# Altium schematic sheet load-sw.SchDoc
size A4
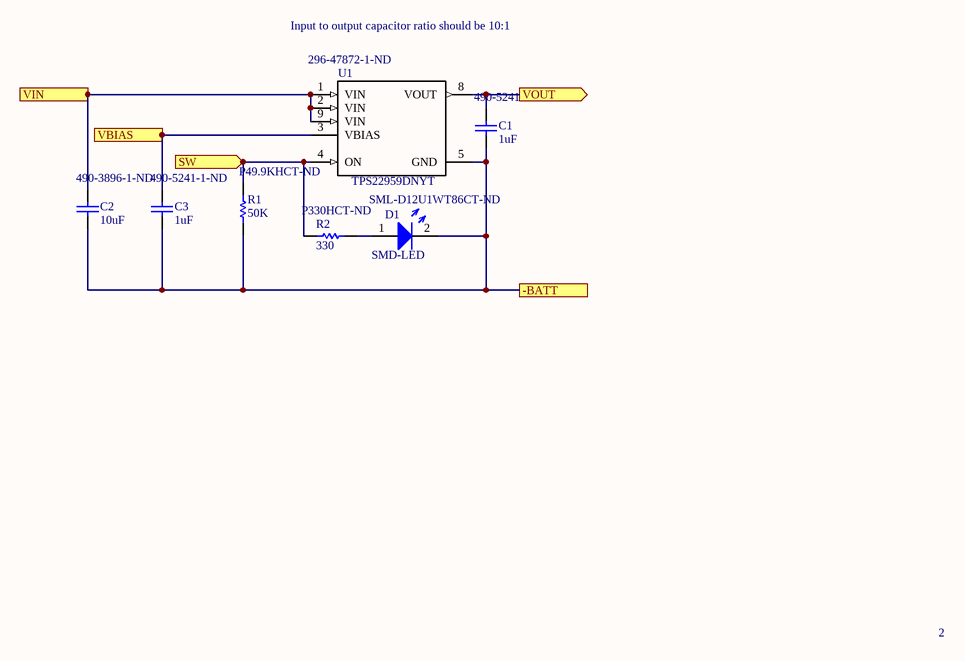
[diagram p0: load-sw.SchDoc]

## Parts
C1  1uF  Supplier Part Number 1: 490-5241-1-ND  [1608[0603]]
C2  10uF  Supplier Part Number 1: 490-3896-1-ND  [1608[0603]]
C3  1uF  Supplier Part Number 1: 490-5241-1-ND  [1608[0603]]
D1  SMD-LED  Supplier Part Number 1: SML-D12U1WT86CT-ND  [0603-LED]
R1  50K  Supplier Part Number 1: P49.9KHCT-ND  [1608[0603]]
R2  330  Supplier Part Number 1: P330HCT-ND  [1608[0603]]
U1  TPS22959DNYT  Supplier Part Number 1: 296-47872-1-ND  [TPS22959DNYT]

## Ports
-BATT, SW (in), VBIAS, VIN (in), VOUT (out)

## Nets
-BATT: C1.1 C2.1 C3.1 D1.2 R1.1 U1.5(GND) ; port -BATT
SW: R1.2 R2.2 U1.4(ON) ; port SW
VBIAS: C3.2 U1.3(VBIAS) ; port VBIAS
VIN: C2.2 U1.1(VIN) U1.2(VIN) U1.9(VIN) ; port VIN
VOUT: C1.2 U1.8(VOUT) ; port VOUT
NetD1_1: D1.1 R2.1

## Notes on the sheet
- Input to output capacitor ratio should be 10:1
- 2

## Library data of the parts
C1 C3 = Cap Semi: Capacitor (Semiconductor SIM Model); Manufacturer: Murata; Manufacturer Part Number: GCM188R71C105KA64D; Description: CAP CER 1UF 16V X7R 0603; Tolerance: 10%; Voltage Rating: 16V; Dielectric: X7R; Published: 8-Jun-2000; LatestRevisionDate: 29-May-2009; LatestRevisionNote: IPC-7351 Footprint Added.; PackageReference: C1206; Publisher: Altium Limited; PackageDescription: Chip Capacitor; Value: 1uF; Supplier 1: Digi-Key; Stock 1: 377297; Pricing 1: 1=0.34, 10=0.235, 100=0.1412, 500=0.10588, 1000=0.08941 (USD); Mount: Surface Mount; Case/Package: 0603; Case Code (Metric): 1608; Case Code (Imperial): 0603; Min Operating Temperature: -55°C; Max Operating Temperature: 125°C; Capacitance: 1uF; Packaging: Tape and Reel; Package Quantity: 1; Voltage Rating (DC): 16V; Termination: SMD/SMT; Voltage: 16V; Length: 1.6mm; Height: 0.8mm; Width: 0.031inch; Thickness: 0.035inch; Depth: 0.8mm; Ratings: AEC-Q200; Radiation Hardening: No; REACH SVHC: No SVHC; Lead Free: Lead Free; ComponentLink1URL: http://psearch.murata.com/capacitor/product/GCM188R71C105KA64%23.pdf?src-supplier=Avnet; ComponentLink1Description: http://psearch.murata.com/capacitor/product/GCM188R71C105KA64%23.pdf?src-supplier=Avnet; ComponentLink2URL: http://www.murata.com/products/catalog/pdf/c03e.pdf?src-supplier=Future+Electronics; ComponentLink2Description: http://www.murata.com/products/catalog/pdf/c03e.pdf?src-supplier=Future+Electronics; ComponentLink3URL: http://search.murata.co.jp/Ceramy/image/img/A01X/partnumbering_e_02.pdf?src-supplier=Digi-Key; ComponentLink3Description: http://search.murata.co.jp/Ceramy/image/img/A01X/partnumbering_e_02.pdf?src-supplier=Digi-Key; ComponentLink4URL: https://www.murata.com/~/media/webrenewal/support/library/catalog/products/capacitor/mlcc/c03e.ashx?la=en-us&src-supplier=Digi-Key; ComponentLink4Description: https://www.murata.com/~/media/webrenewal/support/library/catalog/products/capacitor/mlcc/c03e.ashx?la=en-us&src-supplier=Digi-Key; ComponentLink5URL: http://psearch.murata.com/capacitor/product/GCM188R71C105KA64%23.pdf?src-supplier=Avnet+Europe; ComponentLink5Description: http://psearch.murata.com/capacitor/product/GCM188R71C105KA64%23.pdf?src-supplier=Avnet+Europe
C2 = Cap Semi: Capacitor (Semiconductor SIM Model); Manufacturer: Murata; Manufacturer Part Number: GRM188R60J106ME47D; Description: CAP CER 10UF 6.3V X5R 0603; Material: Ceramic; Tolerance: 20%; Dielectric: X5R; Voltage Rating: 6.3V; Published: 8-Jun-2000; LatestRevisionDate: 29-May-2009; LatestRevisionNote: IPC-7351 Footprint Added.; PackageReference: C1206; Publisher: Altium Limited; PackageDescription: Chip Capacitor; Value: 10uF; Supplier 1: Digi-Key; Stock 1: 21037979; Pricing 1: 1=0.37, 10=0.259, 100=0.1553, 500=0.11644, 1000=0.09833 (USD); Mount: Surface Mount; Case/Package: 0603; Case Code (Metric): 1608; Case Code (Imperial): 0603; Min Operating Temperature: -55°C; Max Operating Temperature: 85°C; Capacitance: 10uF; Packaging: Tape and Reel; Package Quantity: 4000; Voltage Rating (DC): 6.3V; Termination: SMD/SMT; Voltage: 6.3V; Length: 1.6mm; Height: 0.8mm; Width: 0.031inch; Thickness: 0.035inch; Depth: 0.8mm; Radiation Hardening: No; REACH SVHC: No SVHC; Lead Free: Lead Free; ComponentLink1URL: https://www.murata.com/~/media/webrenewal/support/library/catalog/products/capacitor/mlcc/c02e.ashx?la=en-us&src-supplier=Digi-Key; ComponentLink1Description: https://www.murata.com/~/media/webrenewal/support/library/catalog/products/capacitor/mlcc/c02e.ashx?la=en-us&src-supplier=Digi-Key; ComponentLink2URL: http://www.farnell.com/datasheets/2047842.pdf?src-supplier=Farnell; ComponentLink2Description: http://www.farnell.com/datasheets/2047842.pdf?src-supplier=Farnell; ComponentLink3URL: http://components.arrow.com/part/dataview/43432894S8110083N2606?src-supplier=Arrow; ComponentLink3Description: http://components.arrow.com/part/dataview/43432894S8110083N2606?src-supplier=Arrow; ComponentLink4URL: http://www.farnell.com/datasheets/415295.pdf?src-supplier=Element14; ComponentLink4Description: http://www.farnell.com/datasheets/415295.pdf?src-supplier=Element14; ComponentLink5URL: https://www.murata.com/~/media/webrenewal/support/library/catalog/products/capacitor/mlcc/c02e.ashx?src-supplier=Distrelec; ComponentLink5Description: https://www.murata.com/~/media/webrenewal/support/library/catalog/products/capacitor/mlcc/c02e.ashx?src-supplier=Distrelec; ComponentLink6URL: http://search.murata.co.jp/Ceramy/image/img/w_hinm/L0005E.pdf?src-supplier=Future+Electronics; ComponentLink6Description: http://search.murata.co.jp/Ceramy/image/img/w_hinm/L0005E.pdf?src-supplier=Future+Electronics; ComponentLink7URL: http://www.produktinfo.conrad.com/datenblaetter/450000-474999/450781-da-01-de-VS_CHIP_KOND_0603_10_0_UF_20Pr_6_3V_X5R.pdf?src-supplier=Conrad; ComponentLink7Description: http://www.produktinfo.conrad.com/datenblaetter/450000-474999/450781-da-01-de-VS_CHIP_KOND_0603_10_0_UF_20Pr_6_3V_X5R.pdf?src-supplier=Conrad; ComponentLink8URL: http://www.produktinfo.conrad.com/datenblaetter/450000-474999/454401-da-01-en-VS_KONDENSATOR_0603.pdf?src-supplier=Conrad; ComponentLink8Description: http://www.produktinfo.conrad.com/datenblaetter/450000-474999/454401-da-01-en-VS_KONDENSATOR_0603.pdf?src-supplier=Conrad
D1 = LED: Just a generic LED; Manufacturer: Rohm; Manufacturer Part Number: SML-D12U1WT86; Description: LED RED DIFFUSED 1608 SMD; Color: Red; Lens Color: White; Lens Transparency: Diffused; Luminous Intensity: 63mcd; Test Current: 20mA; Dominant Wavelength: 620nm; Forward Voltage: 2.2V; Supplier 1: Digi-Key; Stock 1: 100645; Pricing 1: 1=0.22, 10=0.162, 25=0.1192, 100=0.0853, 250=0.05796, 500=0.05116, 1000=0.04007 (USD); Mount: Surface Mount; Case/Package: 0603; Case Code (Metric): 1608; Case Code (Imperial): 0603; Packaging: Tape and Reel; Length: 1.6mm; Height: 0.65mm; Width: 0.8mm; Lead Free: Lead Free
R1 = Res1: Resistor; Manufacturer: Panasonic; Manufacturer Part Number: ERJ3EKF4992V; Description: RES SMD 49.9K OHM 1% 1/10W 0603; Power Rating: 100mW; Tolerance: 1%; Resistance: 49.9kR; Voltage Rating: 75V; Temperature Coefficient: 100ppm/°C; Voltage Rating (DC): 50V; Published: 8-Jun-2000; LatestRevisionDate: 17-Jul-2002; LatestRevisionNote: Re-released for DXP Platform.; PackageReference: AXIAL-0.3; Publisher: Altium Limited; PackageDescription: Axial Device, Thru-Hole; 2 Leads; 0.3 in Pin Spacing; Value: 50K; Supplier 1: Digi-Key; Stock 1: 454779; Pricing 1: 1=0.1, 10=0.065, 100=0.0264, 1000=0.01186, 2500=0.01029 (USD); Mount: Surface Mount; Case/Package: 0603; Weight: 7.1E-05oz; Case Code (Metric): 1608; Case Code (Imperial): 0603; Contact Plating: Tin; Min Operating Temperature: -55°C; Max Operating Temperature: 155°C; Packaging: Tape and Reel; Package Quantity: 1; Composition: Thick Film; Termination: SMD/SMT; Number of Terminations: 2; Military Standard: Not; Max Power Dissipation: 100mW; Features: Automotive AEC-Q200; Length: 1.6mm; Height: 0.45mm; Width: 0.8mm; Depth: 0.8mm; Radiation Hardening: No; REACH SVHC: No SVHC; Lead Free: Lead Free; ComponentLink1URL: http://www.farnell.com/datasheets/1911175.pdf?src-supplier=Farnell; ComponentLink1Description: http://www.farnell.com/datasheets/1911175.pdf?src-supplier=Farnell; ComponentLink2URL: http://www.farnell.com/datasheets/1911175.pdf?src-supplier=Element14; ComponentLink2Description: http://www.farnell.com/datasheets/1911175.pdf?src-supplier=Element14; ComponentLink3URL: http://industrial.panasonic.com/www-data/pdf/AOA0000/AOA0000CE2.pdf?src-supplier=Future+Electronics; ComponentLink3Description: http://industrial.panasonic.com/www-data/pdf/AOA0000/AOA0000CE2.pdf?src-supplier=Future+Electronics; ComponentLink4URL: http://industrial.panasonic.com/www-data/pdf/AOA0000/AOA0000CE2.pdf?src-supplier=Avnet+Europe; ComponentLink4Description: http://industrial.panasonic.com/www-data/pdf/AOA0000/AOA0000CE2.pdf?src-supplier=Avnet+Europe; ComponentLink5URL: http://industrial.panasonic.com/www-data/pdf/AOA0000/AOA0000CE2.pdf?src-supplier=Avnet; ComponentLink5Description: http://industrial.panasonic.com/www-data/pdf/AOA0000/AOA0000CE2.pdf?src-supplier=Avnet; ComponentLink6URL: http://www.farnell.com/datasheets/1678782.pdf?src-supplier=Element14; ComponentLink6Description: http://www.farnell.com/datasheets/1678782.pdf?src-supplier=Element14; ComponentLink7URL: https://www.verical.com/server-webapp/html/getDatasheet?partID=52039&src-supplier=Verical; ComponentLink7Description: https://www.verical.com/server-webapp/html/getDatasheet?partID=52039&src-supplier=Verical; ComponentLink8URL: http://www.jameco.com/Jameco/Products/ProdDS/1988209.pdf?src-supplier=Jameco; ComponentLink8Description: http://www.jameco.com/Jameco/Products/ProdDS/1988209.pdf?src-supplier=Jameco
R2 = Res1: Resistor; Manufacturer: Panasonic; Manufacturer Part Number: ERJ3EKF3300V; Description: RES SMD 330 OHM 1% 1/10W 0603; Tolerance: 1%; Resistance: 330R; Power Rating: 100mW; Voltage Rating: 75V; Temperature Coefficient: 100ppm/°C; Published: 8-Jun-2000; LatestRevisionDate: 17-Jul-2002; LatestRevisionNote: Re-released for DXP Platform.; PackageReference: AXIAL-0.3; Publisher: Altium Limited; PackageDescription: Axial Device, Thru-Hole; 2 Leads; 0.3 in Pin Spacing; Value: 330; Supplier 1: Digi-Key; Stock 1: 2611011; Pricing 1: 1=0.1, 10=0.065, 100=0.0264, 1000=0.01186, 2500=0.01029 (USD); Mount: Surface Mount; Case/Package: 0603; Number of Pins: 2; Weight: 7.1E-05oz; Case Code (Imperial): 0603; Case Code (Metric): 1608; Contact Plating: Tin; Min Operating Temperature: -55°C; Max Operating Temperature: 155°C; Packaging: Tape and Reel; Package Quantity: 5000; Composition: Thick Film; Termination: SMD/SMT; Number of Terminations: 2; Military Standard: Not; Max Power Dissipation: 100mW; Voltage Rating (DC): 75V; Features: Automotive AEC-Q200; Length: 1.6mm; Height: 0.45mm; Width: 0.8mm; Depth: 0.8mm; Radiation Hardening: No; REACH SVHC: No SVHC; Lead Free: Lead Free; ComponentLink1URL: http://www.farnell.com/datasheets/1911175.pdf?src-supplier=Element14; ComponentLink1Description: http://www.farnell.com/datasheets/1911175.pdf?src-supplier=Element14; ComponentLink2URL: https://industrial.panasonic.com/cdbs/www-data/pdf/RDA0000/DMA0000COL11.pdf?src-supplier=Avnet; ComponentLink2Description: https://industrial.panasonic.com/cdbs/www-data/pdf/RDA0000/DMA0000COL11.pdf?src-supplier=Avnet; ComponentLink3URL: http://www.farnell.com/datasheets/426256.pdf?src-supplier=Element14; ComponentLink3Description: http://www.farnell.com/datasheets/426256.pdf?src-supplier=Element14
U1 = TPS22959DNYT: 5.5V, 15A, 4.4mÎ© Load Switch with Quick Output Discharge 8-WSON -40 to 85; MF: Texas Instruments; Number of Outputs: 1; Quiescent Current: 20.4uA; Package: WSON-8 Texas Instruments; Digi-Key_Part_Number: 296-47872-1-ND; Digi-Key_Purchase_URL: https://www.digikey.ca/product-detail/en/texas-instruments/TPS22959DNYT/296-47872-1-ND/8133221?utm_source=snapeda&utm_medium=aggregator&utm_campaign=symbol; SnapEDA_Link: https://www.snapeda.com/parts/TPS22959DNYT/Texas%20Instruments/view-part/?ref=snap; MP: TPS22959DNYT; Value: *; Supplier 1: Digi-Key; Manufacturer: Texas Instruments; Manufacturer Part Number: TPS22959DNYT; Stock 1: 2432; Pricing 1: 1=1.91, 10=1.711, 100=1.3756 (USD); Mount: Surface Mount; Number of Pins: 8; Min Operating Temperature: -40°C; Max Operating Temperature: 85°C; Number of Channels: 1; Lead Free: Lead Free; ComponentLink1URL: http://www.ti.com/general/docs/lit/getliterature.tsp?genericPartNumber=TPS22959&&fileType=pdf&src-supplier=Avnet; ComponentLink1Description: http://www.ti.com/general/docs/lit/getliterature.tsp?genericPartNumber=TPS22959&&fileType=pdf&src-supplier=Avnet